# EAGLE design CPB_Cassette_Breakout (EAGLE 9.6.2)
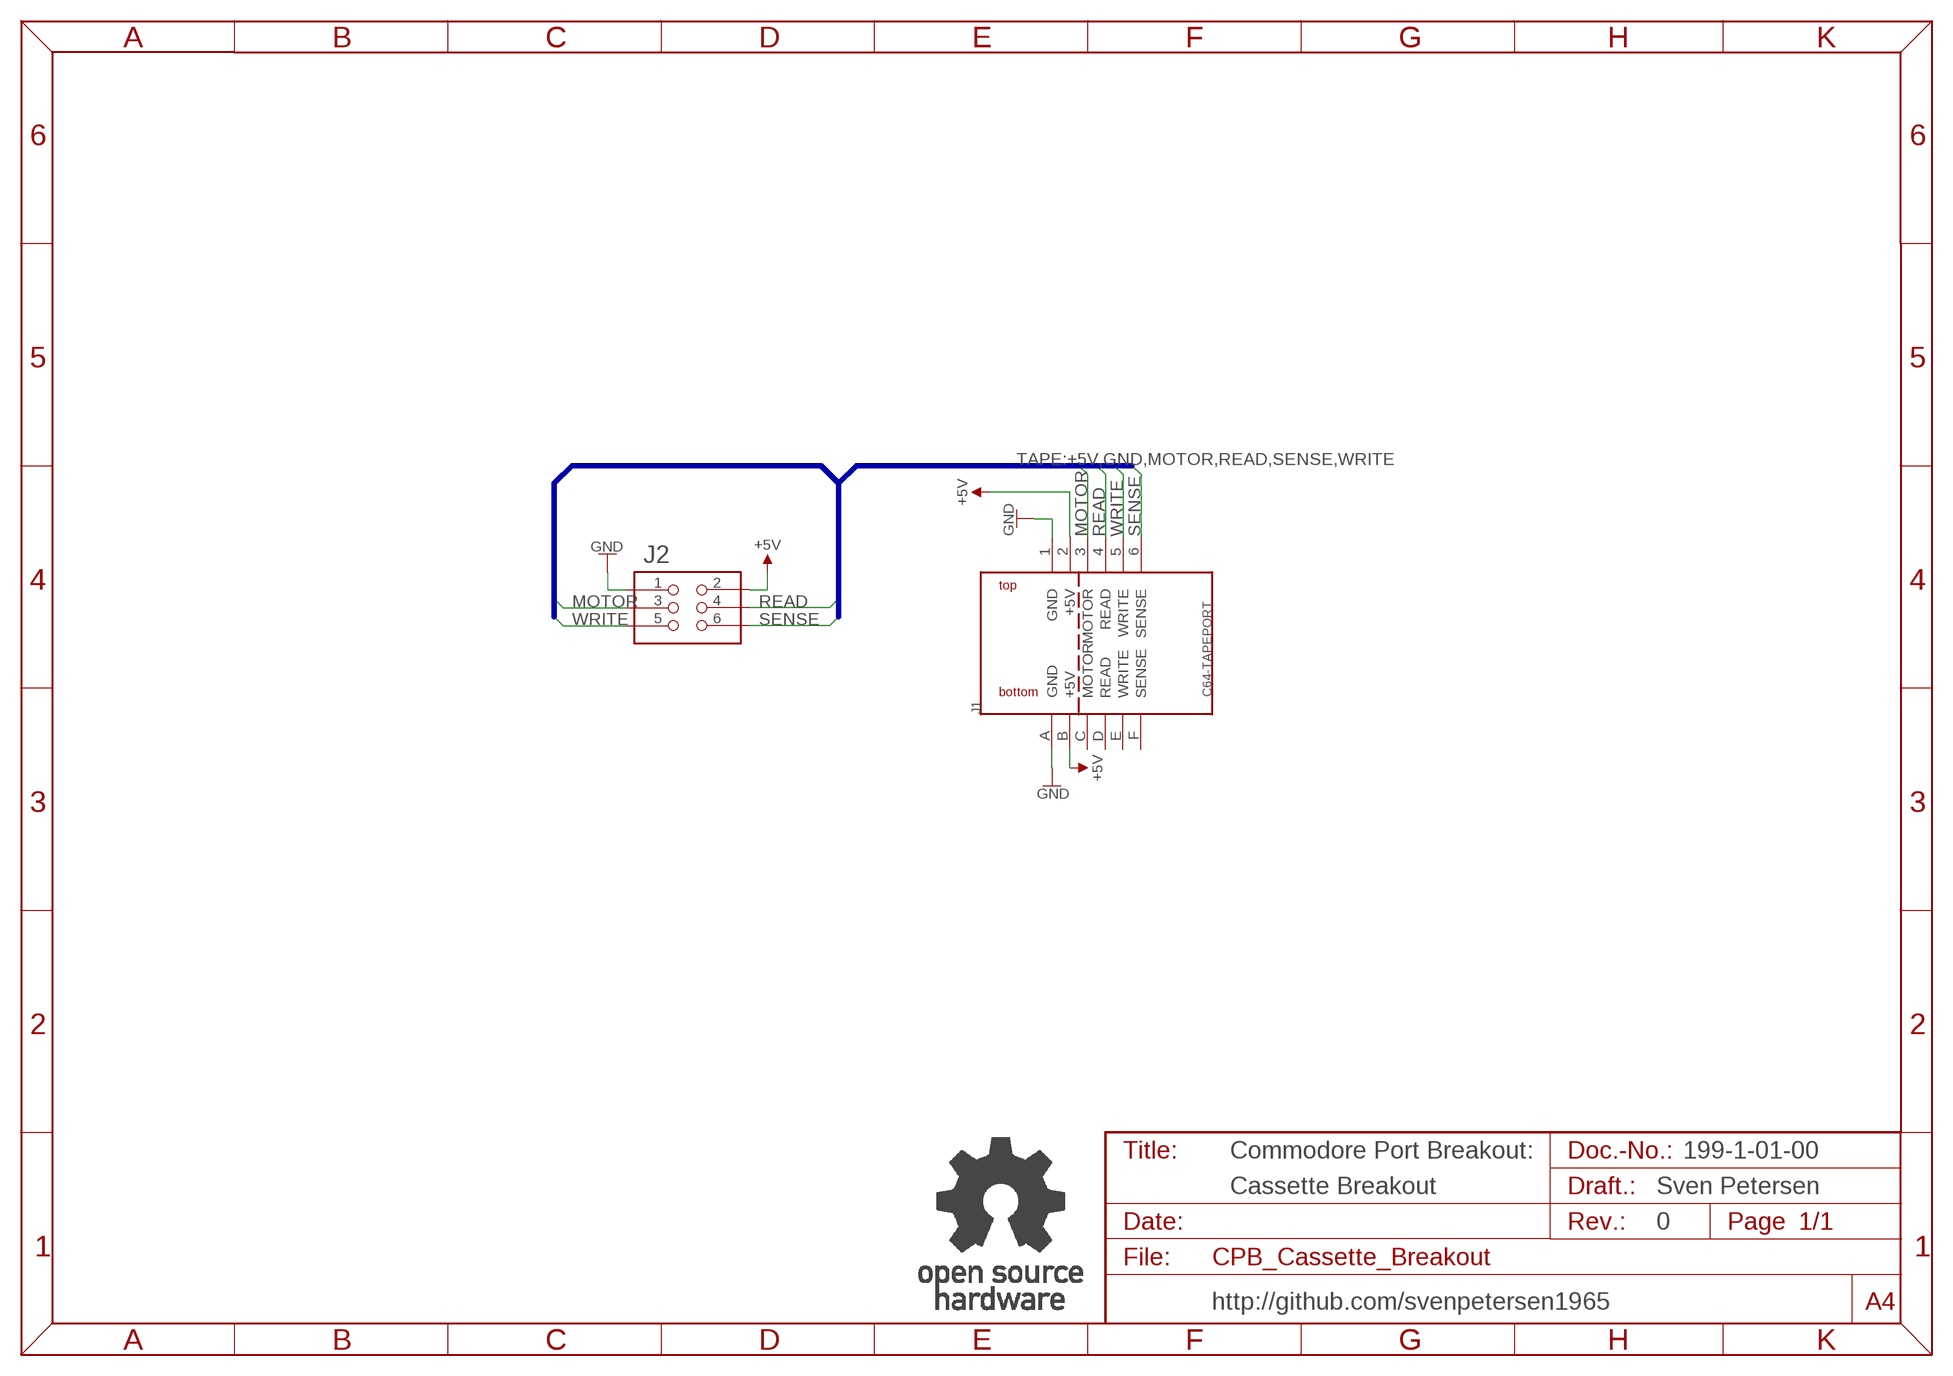
[diagram p0: schematic, sheet 1]

## Parts
J1  C64-TAPEPORT  [TAPEPORT]
J2  2X03WV  [2X03WV]
U$18  OPEN_SOURCE_HW  [OPENHW]

## Nets
+5V: J1.2(+5V) J1.B(+5V) J2.2
GND: J1.1(GND) J1.A(GND) J2.1
MOTOR: J1.3(MOTOR) J2.3
READ: J1.4(READ) J2.4
SENSE: J1.6(SENSE) J2.6
WRITE: J1.5(WRITE) J2.5
Unconnected: J1.C(MOTOR) J1.D(READ) J1.E(WRITE) J1.F(SENSE)

## Buses
TAPE:+5V,GND,MOTOR,READ,SENSE,WRITE

## Notes on the sheet
- Commodore Port Breakout: | 199-1-01-00
- Cassette Breakout | Sven Petersen
- 0
- http://github.com/svenpetersen1965

## Library data of the parts
J1 = Commodore:C64-TAPEPORT
J2 = PINHEAD:2X03WV
U$18 = Logo:OPEN_SOURCE_HW

## Board
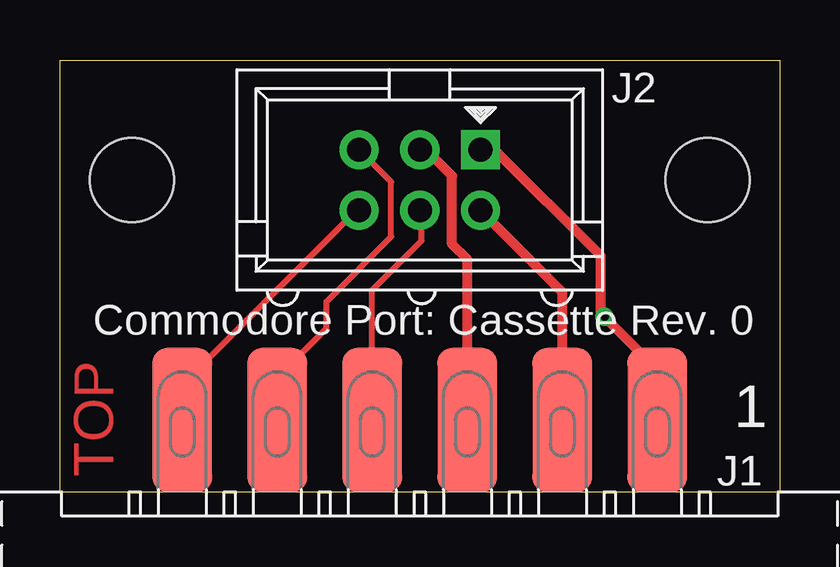
[diagram p1: board, top side]
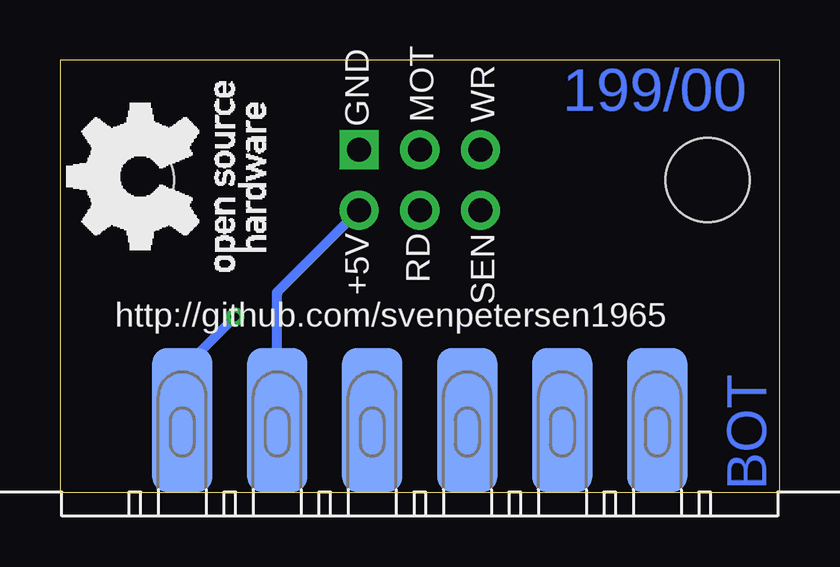
[diagram p2: board, bottom side, seen from below]

Size 30 x 18 mm. Coordinates in mm from the lower left corner, seen from the top.
Outline: 0,0 0,18 30,18 30,0 0,0
Copper layers (1*16): Top 0.035mm / dielectric 1.5mm / Bottom 0.035mm
Design rules "default *": minimum track width 6mil, minimum drill 0.35mm, track to track 6mil, track to pad 6mil, pad to pad 6mil, via to via 6mil, smd to smd 6mil, copper to edge 40mil, drill to drill 6mil, minimum pad ring 10mil, minimum via ring 8mil, stop-mask expansion 4mil, vias tented up to drill 24mil, thermal gap 10mil
Holes 3.5 mm at 3,13 27,13
bRestrict: 2 lines

### Footprints (pad centres in the part's own frame; a part is rotated, then mirrored left to right if it is on the bottom)
TAPEPORT = smd 2.5 x 6: 1 -9.9,-3; 2 -5.94,-3; 3 -1.98,-3; 4 1.98,-3; 5 5.94,-3; 6 9.9,-3 | smd 2.5 x 6 bottom: A -9.9,-3; B -5.94,-3; C -1.98,-3; D 1.98,-3; E 5.94,-3; F 9.9,-3
2X03WV = drill 1 pad 1.626 square: 1 -2.54,-1.27 | drill 1 pad 1.626: 2 -2.54,1.27; 3 0,-1.27; 4 0,1.27; 5 2.54,-1.27; 6 2.54,1.27

### Placement (x,y rotation side)
J1  15,0 180 top
J2  15,13 180 top
U$5  [PCB-TITLE/]  0.16,30.54 0 top  (outside the outline)
U$6  [2LAYER]  2.22,0.64 90 top
U$18  21.43,9.21 90 bottom

### Tracks (layer width: path | path; a pad name or v marks a point on that pad's centre or on a via)
+5V
  Top 0.406: J1.B 20.94,8.33 J2.2
  Bottom 0.406: J1.B 20.94,8.24 20.95,8.26 20.95,8.31 J2.2
GND  (via drill 0.35)
  Top 0.406: J1.1 24.9,5.1 v22.7,7.3 22.54,7.46 22.54,9.84 18.11,14.27 J2.1
  Bottom 0.406: J1.1 24.9,5.1 v22.7,7.3
MOTOR
  Top 0.406: J1.3 16.98,9.69 16.35,10.32 16.35,13.18 15.26,14.27 J2.3
READ
  Top 0.254: J1.4 13.02,8.42 15.08,10.48 15.08,11.65 J2.4
SENSE
  Top 0.254: J1.6 5.1,4.46 12.37,11.73 J2.6
WRITE
  Top 0.254: J1.5 9.06,4.77 11.11,6.83 11.11,7.94 13.81,10.64 13.81,12.92 J2.5

### Text on the board
Bottom: 199/00
tPlace: Commodore Port: Cassette Rev. 0 | 1
bPlace: WR | MOT | GND | SEN | RD | +5V | http://github.com/svenpetersen1965
Document: Sven Petersen | 199-2-01-00 | 2022 | 35µm | 2 | 0